# EAGLE design 8mixer (EAGLE 6.4)
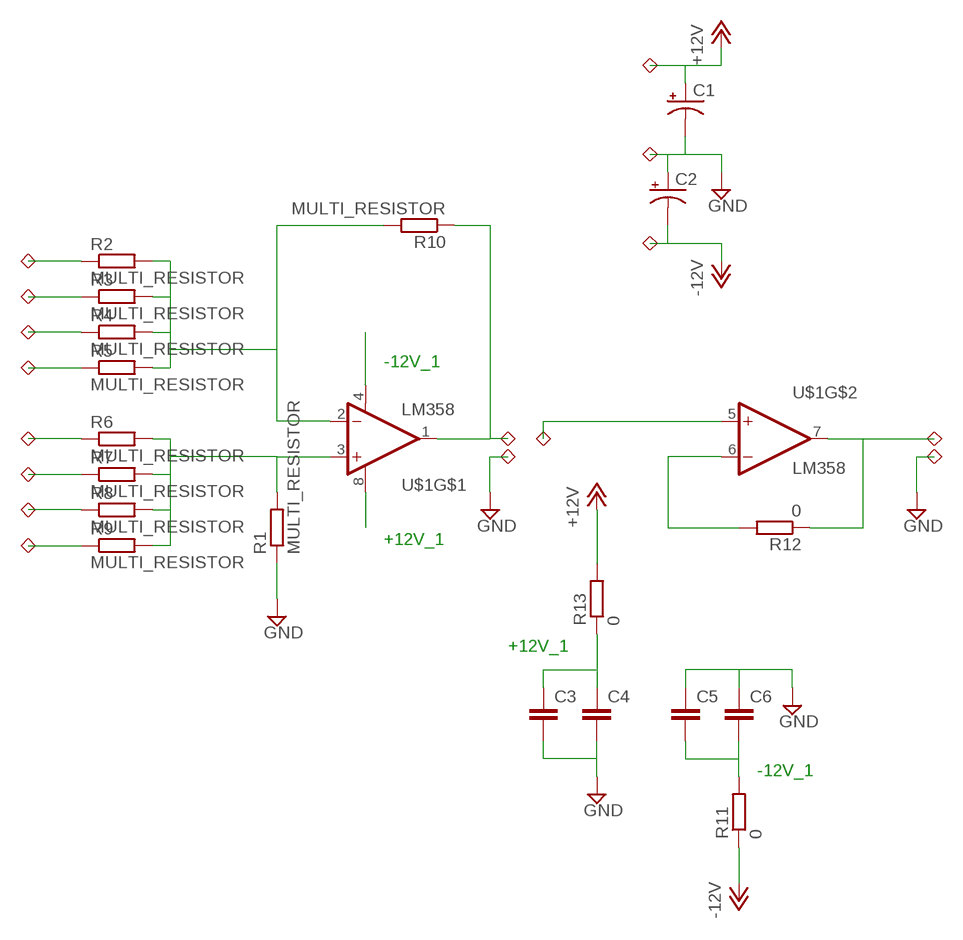
[diagram p0: schematic, sheet 1]

## Parts
C1  CPOL-USSMCE  [SMC_E]
C2  CPOL-USSMCE  [SMC_E]
C3  C-EUC0805  [C0805]
C4  C-EUC0805  [C0805]
C5  C-EUC0805  [C0805]
C6  C-EUC0805  [C0805]
R1  MULTI_RESISTOR  [MULTI_PAD]
R2  MULTI_RESISTOR  [MULTI_PAD]
R3  MULTI_RESISTOR  [MULTI_PAD]
R4  MULTI_RESISTOR  [MULTI_PAD]
R5  MULTI_RESISTOR  [MULTI_PAD]
R6  MULTI_RESISTOR  [MULTI_PAD]
R7  MULTI_RESISTOR  [MULTI_PAD]
R8  MULTI_RESISTOR  [MULTI_PAD]
R9  MULTI_RESISTOR  [MULTI_PAD]
R10  MULTI_RESISTOR  [MULTI_PAD]
R11  0  R-EU_M1206  [M1206]
R12  0  R-EU_M1206  [M1206]
R13  0  R-EU_M1206  [M1206]
U$1  LM358  [SO08]
U$2  1PIN  [THUMBNAIL]
U$3  1PIN  [THUMBNAIL]
U$4  1PIN  [THUMBNAIL]
U$5  1PIN  [THUMBNAIL]
U$6  1PIN  [THUMBNAIL]
U$7  1PIN  [THUMBNAIL]
U$8  1PIN  [THUMBNAIL]
U$9  1PIN  [THUMBNAIL]
U$10  1PIN  [THUMBNAIL]
U$11  1PIN  [THUMBNAIL]
U$12  1PIN  [THUMBNAIL]
U$13  1PIN  [THUMBNAIL]
U$14  1PIN  [THUMBNAIL]
U$15  1PIN  [THUMBNAIL]
U$16  1PIN  [THUMBNAIL]
U$17  1PIN  [THUMBNAIL]

## Nets
+12V: C1.+ R13.2 U$10.P$1
+12V_1: C3.1 C4.1 R13.1 U$1.8(V+)
-12V: C2.- R11.1 U$12.P$1
-12V_1: C5.2 C6.2 R11.2 U$1.4(V-)
GND: C1.- C2.+ C3.2 C4.2 C5.1 C6.1 R1.1 U$11.P$1 U$14.P$1 U$16.P$1
N$1: R2.1 U$2.P$1
N$2: R2.2 R3.2 R4.2 R5.2 R10.2 U$1.2(-IN)
N$3: R12.1 U$1.7(OUT) U$15.P$1
N$4: R3.1 U$3.P$1
N$5: R4.1 U$4.P$1
N$6: R5.1 U$5.P$1
N$7: R6.1 U$6.P$1
N$8: R7.1 U$7.P$1
N$9: R8.1 U$8.P$1
N$10: R9.1 U$9.P$1
N$11: R12.2 U$1.6(-IN)
N$12: R1.2 R6.2 R7.2 R8.2 R9.2 U$1.3(+IN)
N$14: R10.1 U$1.1(OUT) U$13.P$1
N$15: U$1.5(+IN) U$17.P$1

## Notes on the sheet
- -12V_1
- +12V_1
- +12V_1
- -12V_1

## Library data of the parts
C1 C2 = rcl:CPOL-US: POLARIZED CAPACITOR, American symbol
C3-C6 = rcl:C-EU: CAPACITOR, European symbol
R1-R10 = multi-smt:MULTI_RESISTOR
R11-R13 = rcl:R-EU_: RESISTOR, European symbol
U$1 = synth_design:LM358
U$2-U$17 = multi-smt:1PIN

## Board
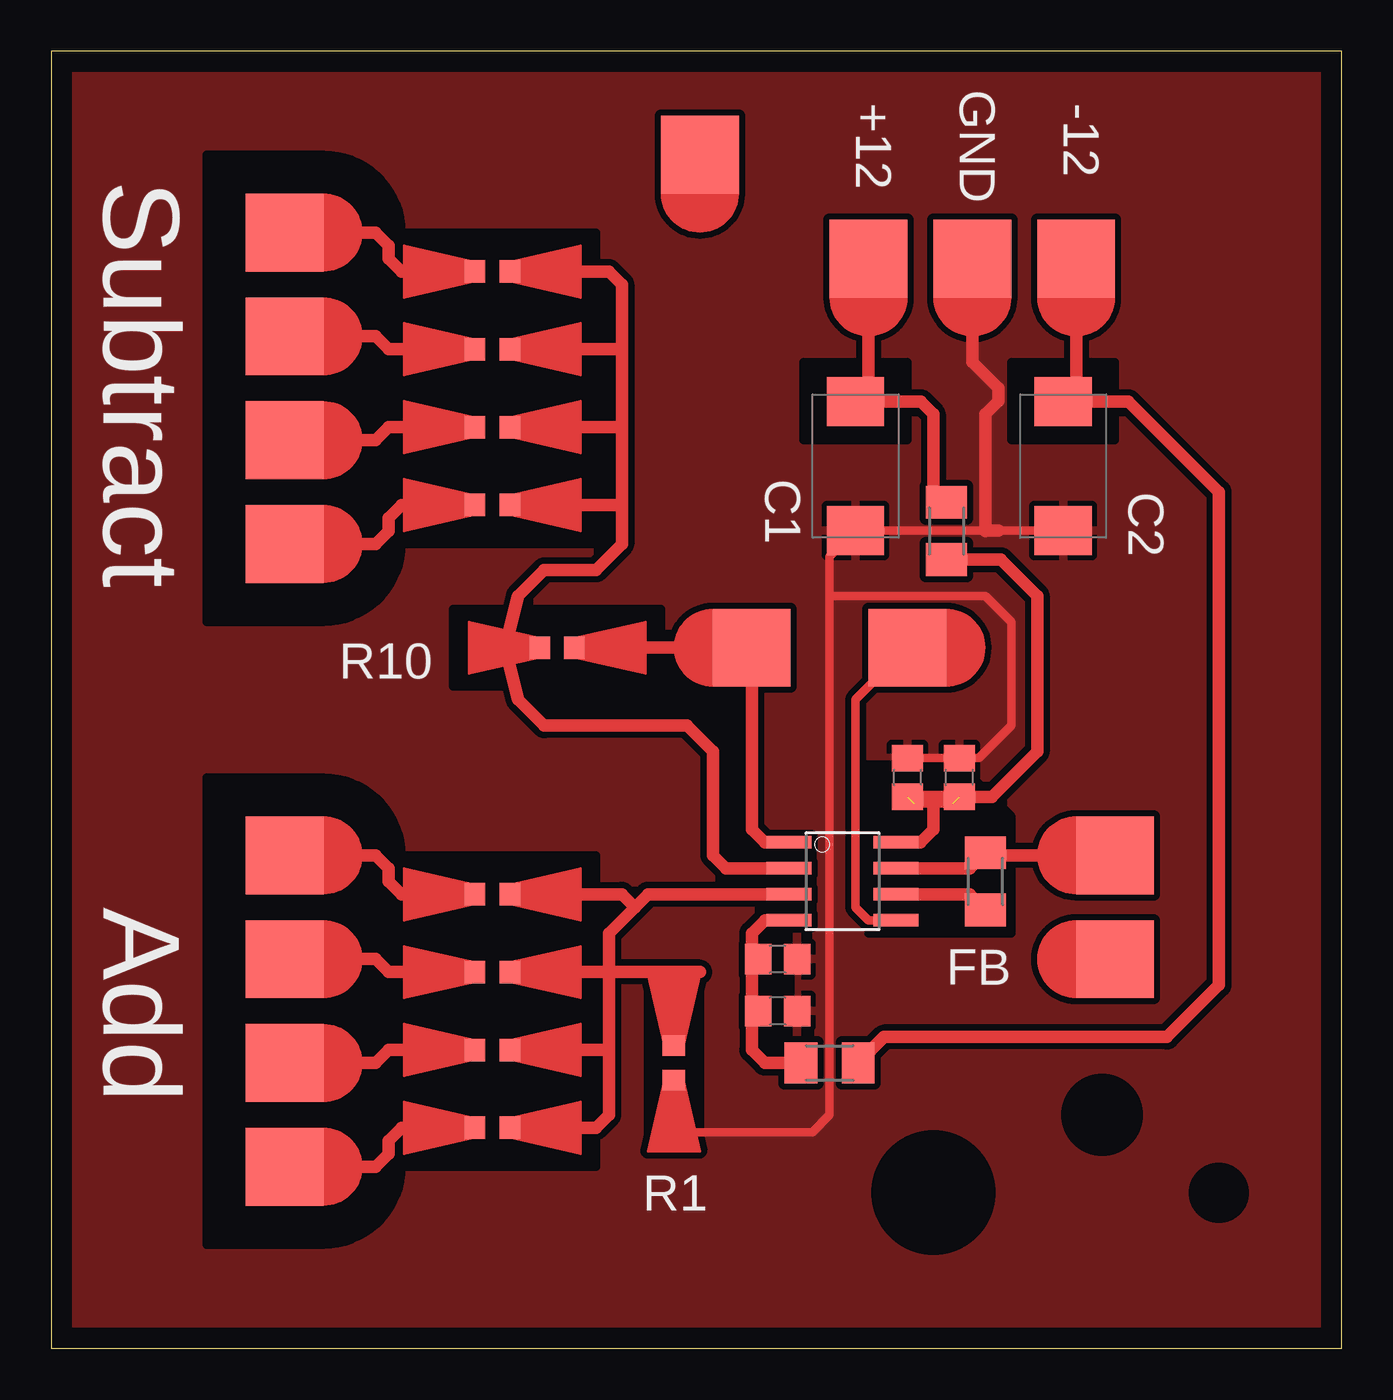
[diagram p1: board, top side]

Size 63.17 x 63.49 mm. Coordinates in mm from the lower left corner, seen from the top.
Outline: 0,0 63.17,0 63.17,63.49 0,63.49 0,0
Copper layers (1*16): Top 0.035mm / dielectric 1.5mm / Bottom 0.035mm
Design rules "default *": minimum track width 10mil, minimum drill 24mil, track to track 12mil, track to pad 12mil, pad to pad 12mil, via to via 12mil, smd to smd 8mil, copper to edge 40mil, drill to drill 8mil, minimum pad ring 10mil, minimum via ring 8mil, stop-mask expansion 4mil, vias tented up to drill 0mil, thermal gap 10mil
tRestrict: area 7.6,35.6 to 26.7,58.4; area 7.6,5.1 to 26.7,27.9; area 29.2,9.5 to 31.8,18.4; area 19.7,32.4 to 29.8,36.2; area 40,20.3 to 47,28.6; area 47,44.5 to 52.1,48.3; area 36.8,44.5 to 41.9,48.3; area 34.3,16.5 to 36.2,19.1; area 40.3,4.8 to 46,10.5; area 49.6,9.6 to 53.2,13.2; area 55.9,6.3 to 58.4,8.9

### Footprints (pad centres in the part's own frame; a part is rotated, then mirrored left to right if it is on the bottom)
SMC_E = smd 2.4 x 2.8: + -3.15,0; - 3.15,0
C0805 = smd 1.3 x 1.5: 1 -0.95,0; 2 0.95,0
MULTI_PAD = smd 1 x 1.1: 1 -0.85,0; 2 0.85,0
M1206 = smd 1.6 x 2: 1 -1.4,0; 2 1.4,0
SO08 = smd 0.61 x 2.21: 1 -1.905,-2.616; 2 -0.635,-2.616; 3 0.635,-2.616; 4 1.905,-2.616; 5 1.905,2.616; 6 0.635,2.616; 7 -0.635,2.616; 8 -1.905,2.616
THUMBNAIL = smd 3.81 x 3.81: P$1 0,0

### Placement (x,y rotation side)
C1  39.37,43.18 270 top
C2  49.53,43.18 90 top
C3  41.91,27.94 90 top
C4  44.45,27.94 90 top
C5  35.56,16.51 180 top
C6  35.56,19.05 180 top
R1  30.48,13.97 90 top
R2  21.59,52.7 0 top
R3  21.59,48.9 0 top
R4  21.59,45.09 0 top
R5  21.59,41.27 0 top
R6  21.59,22.23 0 top
R7  21.59,18.41 0 top
R8  21.59,14.61 0 top
R9  21.59,10.79 0 top
R10  24.77,34.29 180 top
R11  38.1,13.97 180 top
R12  45.72,22.86 270 top
R13  43.81,40.01 90 top
U$1  38.73,22.86 270 top
U$2  11.43,54.61 0 top
U$3  11.43,49.53 0 top
U$4  11.43,44.45 0 top
U$5  11.43,39.37 0 top
U$6  11.43,24.13 0 top
U$7  11.43,19.05 0 top
U$8  11.43,13.97 0 top
U$9  11.43,8.89 0 top
U$10  40.01,53.34 270 top
U$11  45.09,53.34 270 top
U$12  50.16,53.34 270 top
U$13  34.29,34.29 180 top
U$14  31.75,58.42 270 top
U$15  52.07,24.13 180 top
U$16  52.07,19.05 180 top
U$17  41.91,34.29 0 top

### Tracks (layer width: path | path; a pad name or v marks a point on that pad's centre or on a via)
+12V
  Top 0.406: 40.01,46.97 C1.+
  Top 0.61: U$10.P$1 40.01,46.97 | C1.+ 42.57,46.33 43.18,45.72 43.18,42.04 R13.2
+12V_1  (2 unrouted)
  Top 0.406: 44.13,26.67 43.18,26.67 42.23,26.67
  Top 0.61: C3.1 46.04,26.99 48.26,29.21 48.26,36.83 46.48,38.6 R13.1 | U$1.8 42.55,24.77 43.18,25.4 43.18,26.67
-12V
  Top 0.406: 50.16,46.97 C2.-
  Top 0.61: U$12.P$1 50.16,46.97 | C2.- 52.73,46.33 57.15,41.91 57.15,17.78 54.61,15.24 40.77,15.24 R11.1
-12V_1
  Top 0.406: C5.2 34.29,16.51 | C6.2 34.29,19.05
  Top 0.61: U$1.4 34.92,20.95 34.29,20.32 34.29,19.05 34.29,16.51 34.29,14.61 34.92,13.97 R11.2
GND
  Top 0.406: R1.1 30.48,10.58 37.25,10.58 38.1,11.43 38.1,36.83 | 38.1,36.83 38.1,38.76 C1.- 46.35,40.03 C2.+ | U$11.P$1 46.35,52.07 | C4.2 C3.2 45.4,28.89 46.99,30.48 46.99,35.56 45.72,36.83 38.1,36.83
  Top 0.61: 46.35,52.07 45.09,52.07 45.09,48.26 46.35,46.99 46.35,46.35 45.72,45.72 45.72,40.01 45.74,40.03 46.35,40.03
  pour Top: -3.81,64.77 68.58,64.77 68.58,-3.81 -2.54,-1.27
N$1
  Top 0.61: R2.1 17.14,52.7 16.51,53.34 16.51,53.98 15.88,54.61 U$2.P$1
N$2
  Top 0.406: 21.59,34.92 22.23,34.92 22.86,34.29 | 22.86,34.29 R10.2 | 22.23,34.29 22.86,34.29
  Top 0.61: R2.2 27.3,52.7 27.94,52.07 27.94,48.9 | 27.94,48.9 27.94,45.09 | 27.94,45.09 27.94,41.27 | R3.2 27.94,48.9 | R4.2 27.94,45.09 | R5.2 27.94,41.27 | U$1.2 33.02,23.5 32.38,24.13 32.38,29.21 31.11,30.48 24.13,30.48 22.86,31.75 22.23,34.29 22.86,36.83 24.13,38.1 26.67,38.1 27.94,39.37 27.94,41.27
N$3
  Top 0.406: 45.85,24.13 R12.1
  Top 0.61: U$15.P$1 45.85,24.13 | U$1.7 44.95,23.5 R12.1
N$4
  Top 0.61: R3.1 16.51,48.9 15.88,49.53 U$3.P$1
N$5
  Top 0.61: R4.1 16.51,45.09 15.88,44.45 U$4.P$1
N$6
  Top 0.61: R5.1 17.14,41.27 16.51,40.64 16.51,40.01 15.88,39.37 U$5.P$1
N$7
  Top 0.61: R6.1 17.14,22.23 16.51,22.86 16.51,23.5 15.88,24.13 U$6.P$1
N$8
  Top 0.61: R7.1 16.51,18.41 15.88,19.05 U$7.P$1
N$9
  Top 0.61: R8.1 16.51,14.61 15.88,13.97 U$8.P$1
N$10
  Top 0.61: R9.1 17.14,10.79 16.51,10.16 16.51,9.53 15.88,8.89 U$9.P$1
N$11
  Top 0.61: U$1.6 44.95,22.23 R12.2
N$12
  Top 0.406: R1.2 30.9,17.36 31.75,18.41
  Top 0.61: R9.2 26.67,10.79 27.3,11.43 27.3,14.61 | 27.3,14.61 27.3,18.41 | 27.3,18.41 27.3,20.32 28.57,21.59 | R8.2 27.3,14.61 | R7.2 27.3,18.41 | 31.75,18.41 27.3,18.41 | R6.2 27.94,22.23 28.57,21.59 | U$1.3 29.21,22.23 28.57,21.59
N$14
  Top 0.61: U$1.1 34.92,24.77 34.29,25.4 U$13.P$1 R10.1
N$15
  Top 0.406: U$17.P$1 39.37,31.75 39.37,21.59 40.01,20.95 U$1.5

### Text on the board
tNames: GND | +12 | -12 | Subtract | Add | FB